# Altium schematic sheet Sensors&Actuators.SchDoc
size A4; SheetNumber: 3; SheetTotal: 4
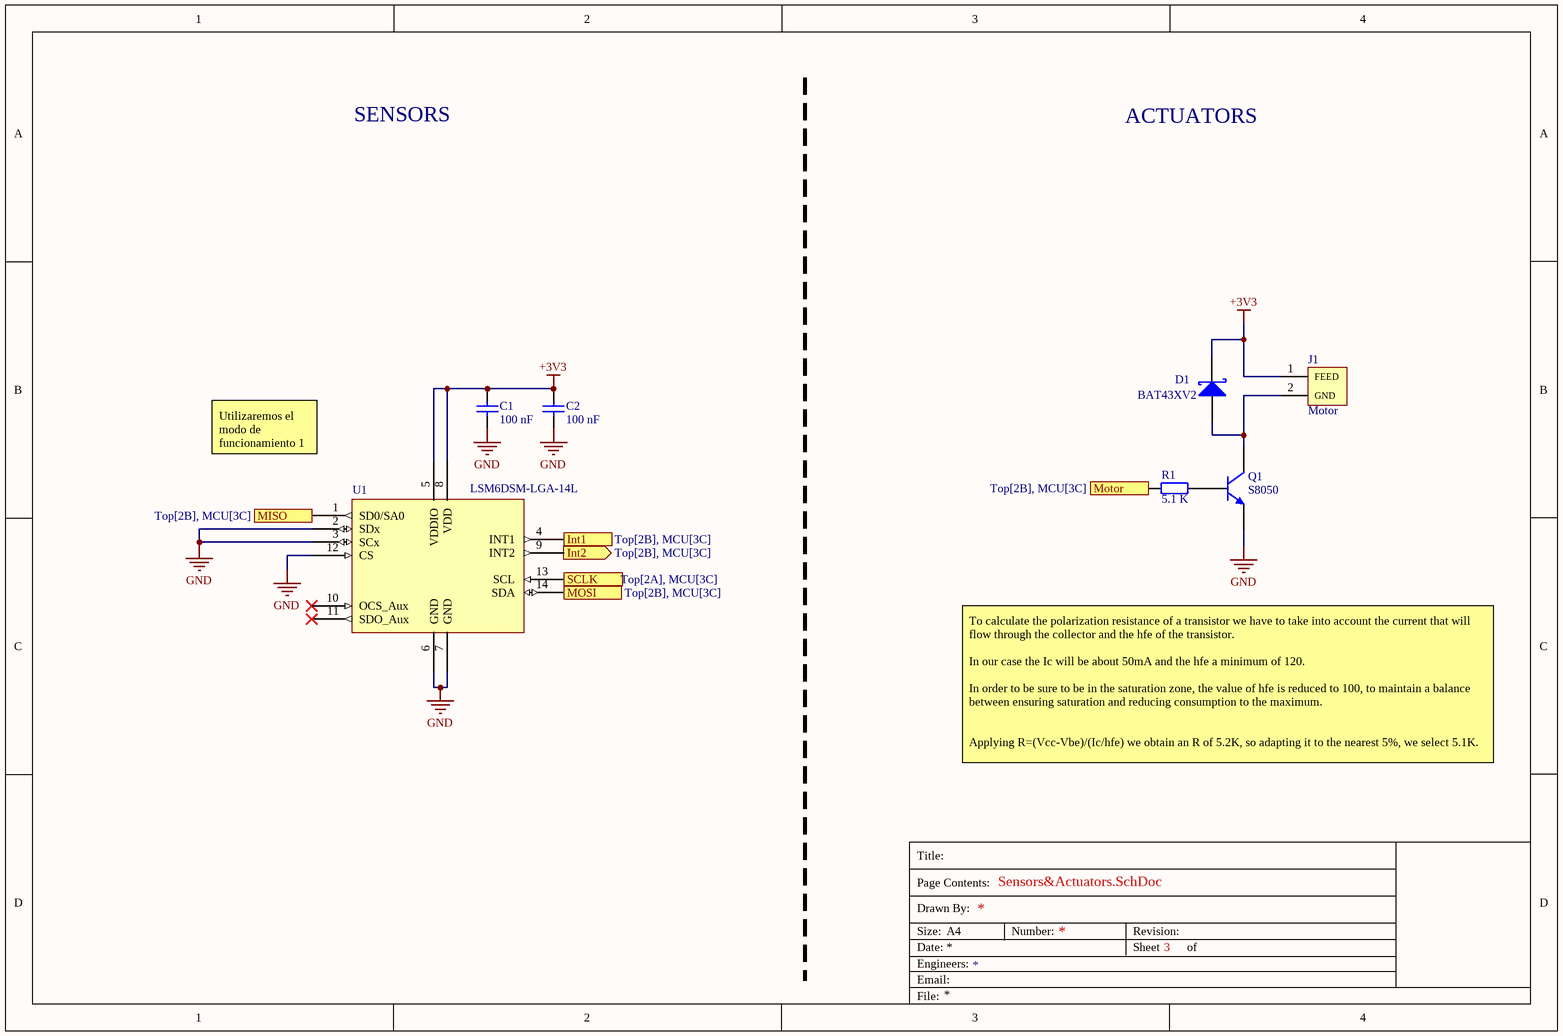
[diagram p0: Sensors&Actuators.SchDoc]

## Parts
C1  100 nF  [C0402]
C2  100 nF  [C0402]
D1  BAT43XV2  [SOD_523]
J1  Motor  [Hand solder wire polarity]
Q1  S8050  [SOT23]
R1  5.1 K  [R0402]
U1  LSM6DSM-LGA-14L  [LSM6DSM-LGA-14L-v2]

## Ports
Int1 (out, see Top[2B], MCU[3C]), Int2 (out, see Top[2B], MCU[3C]), MISO (out, see Top[2B], MCU[3C]), MOSI (in, see Top[2B], MCU[3C]), Motor (in, see Top[2B], MCU[3C]), SCLK (in, see Top[2A], MCU[3C])

## Nets
+3V3: C1.1 C2.1 D1.2(K) J1.1(FEED) U1.5(VDDIO) U1.8(VDD)
GND: C1.2 C2.2 Q1.2(E) U1.2(SDx) U1.3(SCx) U1.6(GND) U1.7(GND) U1.12(CS)
Int1: U1.4(INT1) ; port Int1
Int2: U1.9(INT2) ; port Int2
MISO: U1.1(SD0/SA0) ; port MISO
MOSI: U1.14(SDA) ; port MOSI
Motor: R1.1 ; port Motor
SCLK: U1.13(SCL) ; port SCLK
NetD1_1: D1.1(A) J1.2(GND) Q1.3(C)
NetQ1_1: Q1.1(B) R1.2

Not connected (* = marked no-connect by the designer): U1 10(OCS_Aux)* 11(SDO_Aux)*

## Notes on the sheet
- SENSORS
- ACTUATORS
- Utilizaremos el modo de funcionamiento 1
- To calculate the polarization resistance of a transistor we have to take into account the current that will flow through the collector and the hfe of the transistor.
  In our case the Ic will be about 50mA and the hfe a minimum of 120.
  In order to be sure to be in the saturation zone, the value of hfe is reduced to 100, to maintain a balance between ensuring saturation and reducing consumption to the maximum.
  Applying R=(Vcc-Vbe)/(Ic/hfe) we obtain an R of 5.2K, so adapting it to the nearest 5%, we select 5.1K.
- Title:
- Drawn By:
- Page Contents:
- Size:
- Date:
- File:
- Engineers:
- Email:
- A4
- Number:
- Revision:
- Sheet
- of

## Library data of the parts
C1 C2 = C: Capacitor
D1 = D Schottky: Schottky Diode
Q1 = NPN: NPN Bipolar Transistor
R1 = R: Resistor
U1 = LSM6DSM-LGA-14L: 6-axis IMU, Accel&Gyro